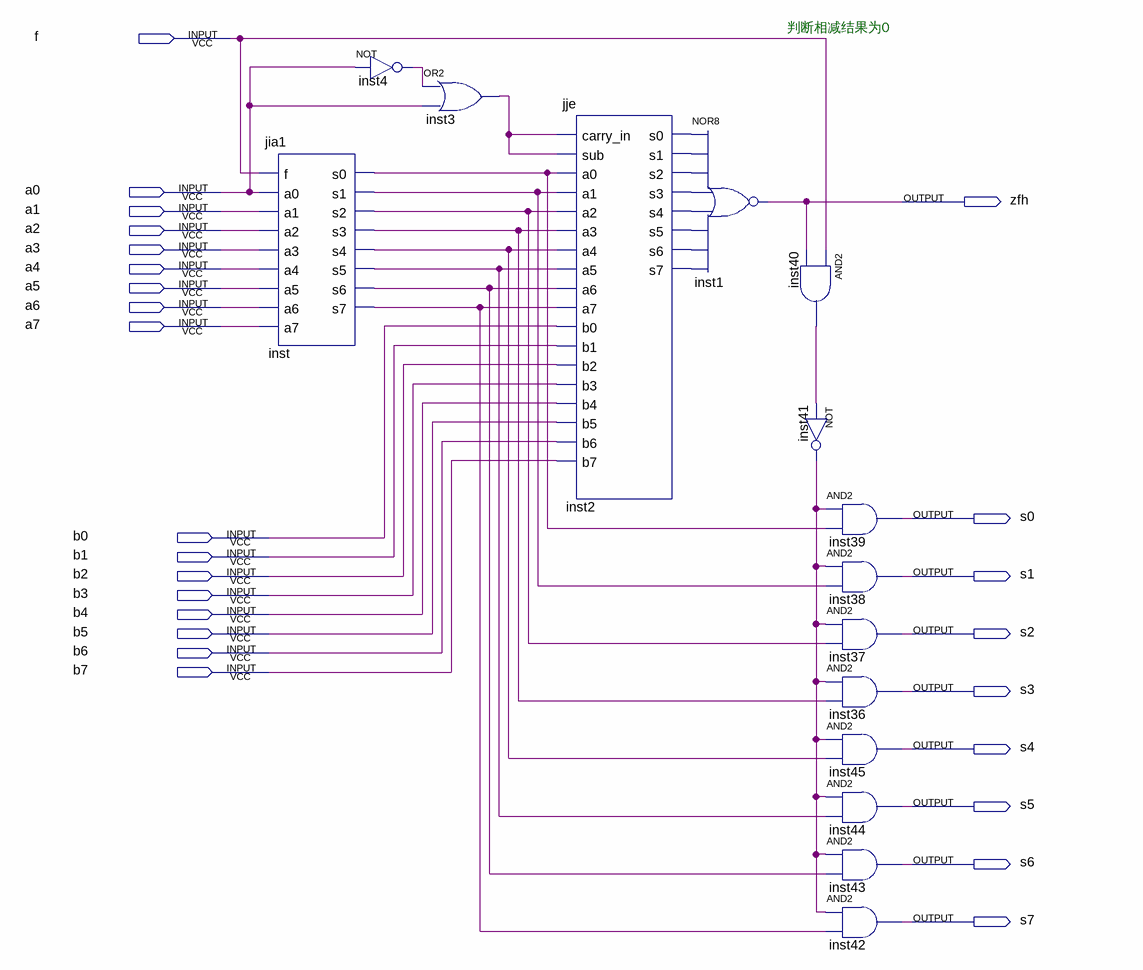
[diagram p0: schematic sheet]
// Quartus schematic zfh.bdf as structural Verilog: 15 symbols, 26 pins
module zfh (
  input  f,
  input  a0,
  input  a1,
  input  a2,
  input  a3,
  input  a4,
  input  a5,
  input  a6,
  input  a7,
  input  b0,
  input  b1,
  input  b2,
  input  b3,
  input  b4,
  input  b5,
  input  b6,
  input  b7,
  output zfh,
  output s0,
  output s1,
  output s2,
  output s3,
  output s4,
  output s5,
  output s6,
  output s7
);

  wire inst2_s0, inst2_s1, inst2_s2, inst2_s3, inst2_s4, inst2_s5, inst2_s6, inst2_s7, inst3_out, inst4_out,
       inst40_out, inst41_out, inst_s0, inst_s1, inst_s2, inst_s3, inst_s4, inst_s5, inst_s6, inst_s7;

  jia1 inst (
    .f(f), .a0(a0), .a1(a1), .a2(a2), .a3(a3), .a4(a4), .a5(a5), .a6(a6), .a7(a7), .s0(inst_s0),
    .s1(inst_s1), .s2(inst_s2), .s3(inst_s3), .s4(inst_s4), .s5(inst_s5), .s6(inst_s6), .s7(inst_s7));
  not inst4 (inst4_out, a0);
  or inst3 (inst3_out, inst4_out, a0);
  jje inst2 (
    .carry_in(inst3_out), .sub(inst3_out), .a0(inst_s0), .a1(inst_s1), .a2(inst_s2), .a3(inst_s3),
    .a4(inst_s4), .a5(inst_s5), .a6(inst_s6), .a7(inst_s7), .b0(b0), .b1(b1), .b2(b2), .b3(b3), .b4(b4),
    .b5(b5), .b6(b6), .b7(b7), .s0(inst2_s0), .s1(inst2_s1), .s2(inst2_s2), .s3(inst2_s3), .s4(inst2_s4),
    .s5(inst2_s5), .s6(inst2_s6), .s7(inst2_s7));
  nor inst1 (zfh, inst2_s0, inst2_s1, inst2_s2, inst2_s3, inst2_s4, inst2_s5, inst2_s6, inst2_s7);
  and inst40 (inst40_out, f, zfh);
  not inst41 (inst41_out, inst40_out);
  and inst39 (s0, inst41_out, inst_s0);
  and inst38 (s1, inst41_out, inst_s1);
  and inst37 (s2, inst41_out, inst_s2);
  and inst36 (s3, inst41_out, inst_s3);
  and inst45 (s4, inst41_out, inst_s4);
  and inst44 (s5, inst41_out, inst_s5);
  and inst43 (s6, inst41_out, inst_s6);
  and inst42 (s7, inst41_out, inst_s7);

  // Notes on the sheet:
  //   判断相减结果为0
endmodule
